# Altium project Analizador_de_espectro.PrjPcb
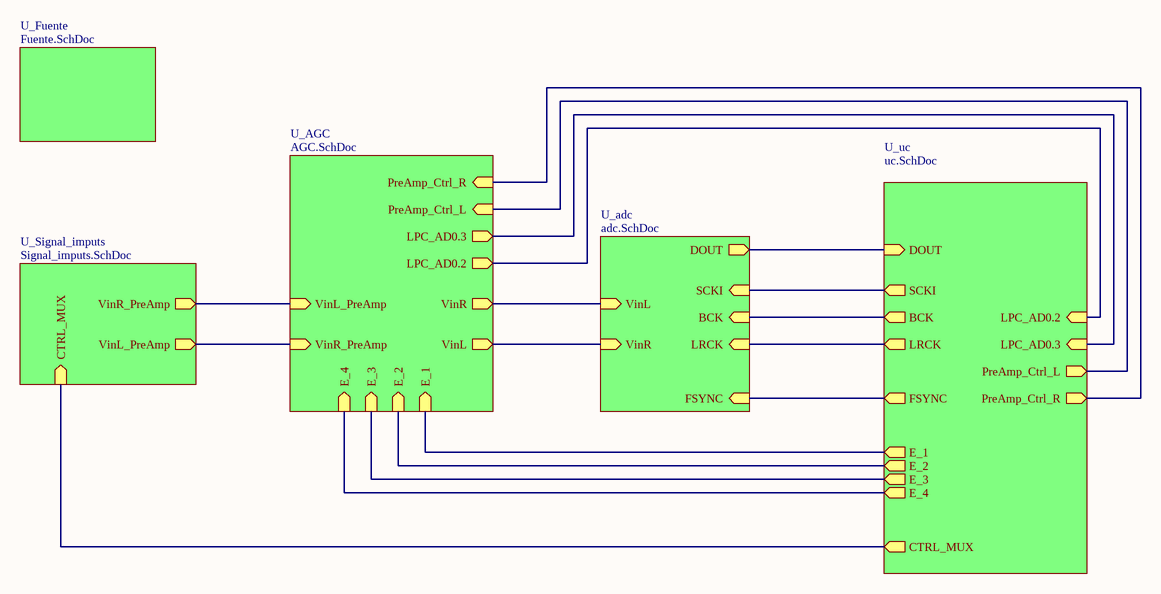
[diagram p0: Analizador_de_espectro.SchDoc]
6 sheets, 140 parts. Net scope: hierarchical (ports join the sheet entries above them; power ports are global).
Board file: Analizador_de_espectro.PcbDoc
Sheets:
  Analizador_de_espectro.SchDoc
    U_adc = adc.SchDoc
    U_Fuente = Fuente.SchDoc
    U_uc = uc.SchDoc
    U_AGC = AGC.SchDoc
    U_Signal_imputs = Signal_imputs.SchDoc

## Sheet Analizador_de_espectro.SchDoc: Analizador_de_Espectro_SCH
size A4; Date: 09/09/2017; Author: Hojnadel - Salazar Ato; Organization: UTN.FRBA; Revision: Rev1.0; SheetNumber: 1; SheetTotal: 6

### Sub-sheets
U_adc = adc.SchDoc: SCKI (in), DOUT (out), BCK (in), LRCK (in), FSYNC (in), VinL (in), VinR (in)
U_AGC = AGC.SchDoc: VinR (out), VinL (out), VinL_PreAmp (in), VinR_PreAmp (in), E_1 (in), E_2 (in), E_3 (in), E_4 (in), PreAmp_Ctrl_L (in), PreAmp_Ctrl_R (in), LPC_AD0.3 (out), LPC_AD0.2 (out)
U_Fuente = Fuente.SchDoc: no entries
U_Signal_imputs = Signal_imputs.SchDoc: CTRL_MUX (in), VinR_PreAmp (out), VinL_PreAmp (out)
U_uc = uc.SchDoc: DOUT (in), BCK (out), LRCK (out), SCKI (out), FSYNC (out), CTRL_MUX (out), E_2 (out), E_3 (out), E_1 (out), E_4 (out), PreAmp_Ctrl_L (out), PreAmp_Ctrl_R (out), LPC_AD0.3 (in), LPC_AD0.2 (in)

### Nets
CTRL_MUX: sheet U_uc/CTRL_MUX, sheet U_Signal_imputs/CTRL_MUX
E1: sheet U_uc/E_1, sheet U_AGC/E_1
E2: sheet U_uc/E_2, sheet U_AGC/E_2
E3: sheet U_uc/E_3, sheet U_AGC/E_3
E4: sheet U_uc/E_4, sheet U_AGC/E_4
R_Sw_B_1: sheet U_adc/VinR, sheet U_AGC/VinL
R_Sw_B_2: sheet U_adc/VinL, sheet U_AGC/VinR
VinL: sheet U_AGC/VinR_PreAmp, sheet U_Signal_imputs/VinL_PreAmp
VinR: sheet U_AGC/VinL_PreAmp, sheet U_Signal_imputs/VinR_PreAmp
NetIC1_9: sheet U_adc/FSYNC, sheet U_uc/FSYNC
NetIC1_10: sheet U_adc/LRCK, sheet U_uc/LRCK
NetIC1_11: sheet U_adc/BCK, sheet U_uc/BCK
NetIC1_12: sheet U_adc/DOUT, sheet U_uc/DOUT
NetIC1_15: sheet U_adc/SCKI, sheet U_uc/SCKI
NetIC4_1: sheet U_uc/PreAmp_Ctrl_L, sheet U_AGC/PreAmp_Ctrl_L
NetIC4_5: sheet U_uc/PreAmp_Ctrl_R, sheet U_AGC/PreAmp_Ctrl_R
NetIC4_7: sheet U_uc/LPC_AD0.2, sheet U_AGC/LPC_AD0.2
NetIC4_9: sheet U_uc/LPC_AD0.3, sheet U_AGC/LPC_AD0.3

## Sheet adc.SchDoc: ADC_PCM1802_SCH
size A3; Author: Hojnadel - Salazar Ato; Revision: Rev1.0; SheetNumber: 5; SheetTotal: 6
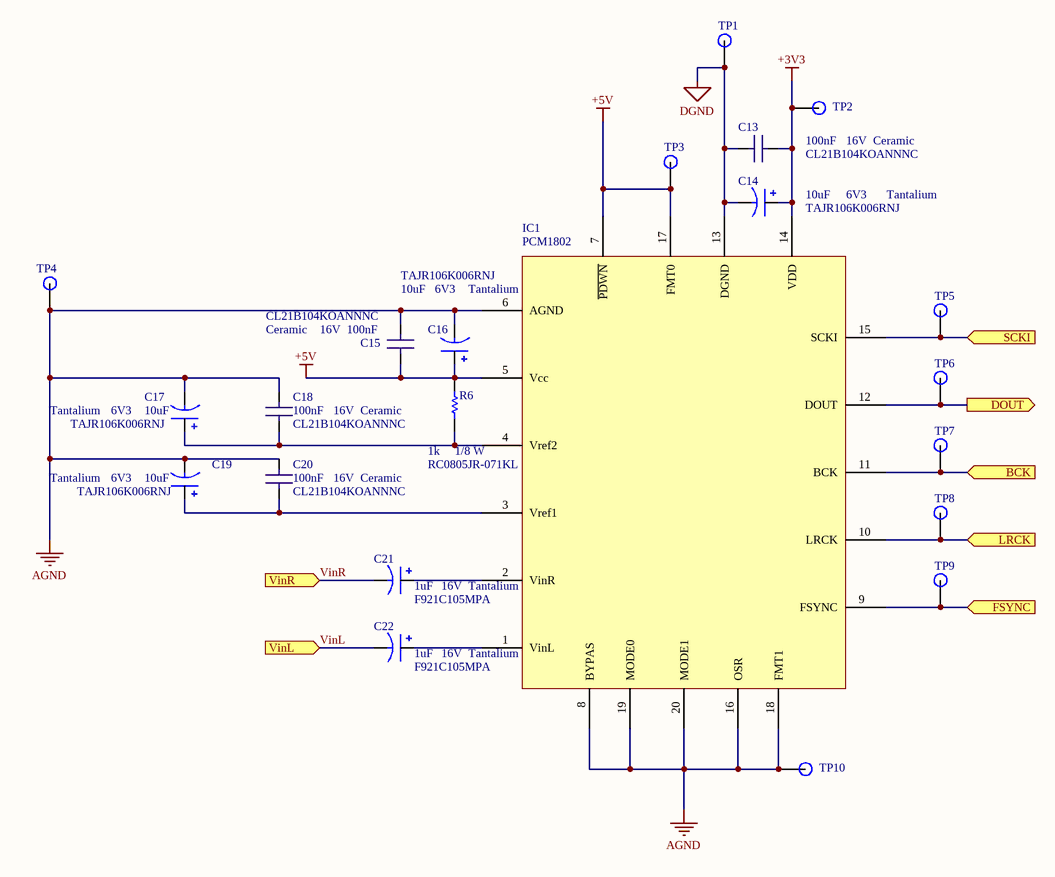
[diagram p1: adc.SchDoc]

### Parts
C13  C: 100nF  V: 16V  Part Number: CL21B104KOANNNC  Material: Ceramic  [C_0805]  (hidden comment: 100nF 16V Ceramic)
C14  C: 10uF  V: 6V3  Material: Tantalium  Part number: TAJR106K006RNJ  [C_0805_pol]  (hidden comment: 10uF 6V3 Tantalium)
C15  C: 100nF  V: 16V  Part Number: CL21B104KOANNNC  Material: Ceramic  [C_0805]  (hidden comment: 100nF 16V Ceramic)
C16  C: 10uF  V: 6V3  Material: Tantalium  Part number: TAJR106K006RNJ  [C_0805_pol]  (hidden comment: 10uF 6V3 Tantalium)
C17  C: 10uF  V: 6V3  Material: Tantalium  Part number: TAJR106K006RNJ  [C_0805_pol]  (hidden comment: 10uF 6V3 Tantalium)
C18  C: 100nF  V: 16V  Part Number: CL21B104KOANNNC  Material: Ceramic  [C_0805]  (hidden comment: 100nF 16V Ceramic)
C19  C: 10uF  V: 6V3  Material: Tantalium  Part number: TAJR106K006RNJ  [C_0805_pol]  (hidden comment: 10uF 6V3 Tantalium)
C20  C: 100nF  V: 16V  Part Number: CL21B104KOANNNC  Material: Ceramic  [C_0805]  (hidden comment: 100nF 16V Ceramic)
C21  C: 1uF  V: 16V  Material: Tantalium  Part number: F921C105MPA  [C_0805_pol]  (hidden comment: 1uF 16V Tantalium)
C22  C: 1uF  V: 16V  Material: Tantalium  Part number: F921C105MPA  [C_0805_pol]  (hidden comment: 1uF 16V Tantalium)
IC1  PCM1802  [SSOP_DB20]
R6  value 1k  Power: 1/8 W  Part Number: RC0805JR-071KL  [R_0805]  (hidden comment: 1k 1/8W)
TP1  TP  [TP]  (value not drawn)
TP2  TP  [TP]  (value not drawn)
TP3  TP  [TP]  (value not drawn)
TP4  TP  [TP]  (value not drawn)
TP5  TP  [TP]  (value not drawn)
TP6  TP  [TP]  (value not drawn)
TP7  TP  [TP]  (value not drawn)
TP8  TP  [TP]  (value not drawn)
TP9  TP  [TP]  (value not drawn)
TP10  TP  [TP]  (value not drawn)

### Ports
BCK (in), DOUT (out), FSYNC (in), LRCK (in), SCKI (in), VinL (in), VinR (in)

### Nets
+3V3: C13.2 C14.1 IC1.14(VDD) TP2.1  [project net VCC]
+5V: C15.2 C16.1 IC1.5(Vcc) IC1.7(~{PDWN}) IC1.17(FMT0) R6.1 TP3.1
AGND: C15.1 C16.2 C17.2 C18.1 C19.2 C20.1 IC1.6(AGND) IC1.8(BYPAS) IC1.16(OSR) IC1.18(FMT1) IC1.19(MODE0) IC1.20(MODE1) TP4.1 TP10.1
DGND: C13.1 C14.2 IC1.13(DGND) TP1.1  [project net GND]
VinL: C22.2 ; port VinL  [project net R_Sw_B_2]
VinR: C21.2 ; port VinR  [project net R_Sw_B_1]
NetC17_1: C17.1 C18.2 IC1.4(Vref2) R6.2
NetC19_1: C19.1 C20.2 IC1.3(Vref1)
NetC21_1: C21.1 IC1.2(VinR)
NetC22_1: C22.1 IC1.1(VinL)
NetIC1_9: IC1.9(FSYNC) TP9.1 ; port FSYNC
NetIC1_10: IC1.10(LRCK) TP8.1 ; port LRCK
NetIC1_11: IC1.11(BCK) TP7.1 ; port BCK
NetIC1_12: IC1.12(DOUT) TP6.1 ; port DOUT
NetIC1_15: IC1.15(SCKI) TP5.1 ; port SCKI

### Notes on the sheet
- (in symbol Cap1) Ceramico

### Library data of the parts
C13 C15 C18 C20 = Cap1: Capacitor
C14 C16 C17 C19 C21 C22 = Cap_Elec: Capacitor
IC1 = PCM1802: Part Number: PCM1802DBR
R6 = Res1: Resistor
TP1-TP10 = Test Point

## Sheet Fuente.SchDoc: Fuente_SCH
size A4; Author: Hojnadel - Salazar Ato; Revision: Rev1.0; SheetNumber: 2; SheetTotal: 6
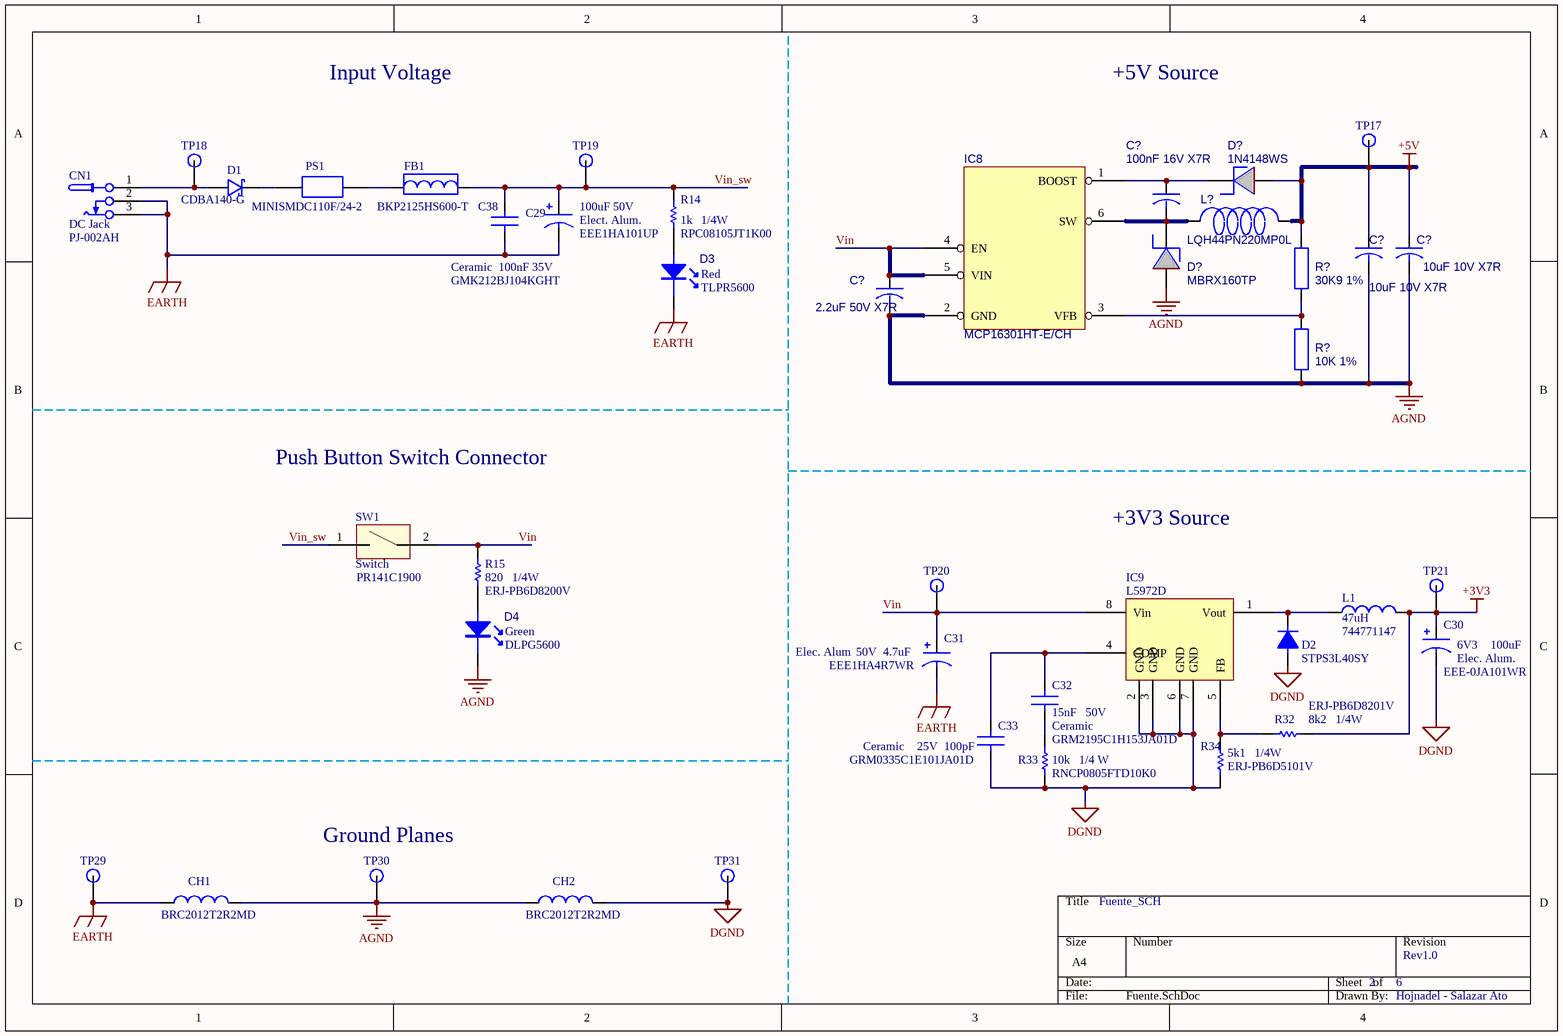
[diagram p2: Fuente.SchDoc]

### Parts
(Parts that share a designator on the sheet are numbered #1, #2 ... from top to bottom, then left to right.)
C29  C: 100uF  V: 50V  Material: Elect. Alum.  Part number: EEE1HA101UP  [C_AE10083X105M]  (hidden comment: 100uF 50V ElecAlum)
C30  C: 100uF  V: 6V3  Material: Elec. Alum.  Part number: EEE-0JA101WR  [C_AE6553X54M]  (hidden comment: 100uF 6V3 ElecAlum)
C31  C: 4.7uF  V: 50V  Material: Elec. Alum  Part number: EEE1HA4R7WR  [C_AE6553X54M]  (hidden comment: 4.7uF 50V ElecAlum)
C32  C: 15nF  V: 50V  Part Number: GRM2195C1H153JA01D  Material: Ceramic  [C_0805]  (hidden comment: 15nF 50V Ceramic)
C33  C: 100pF  V: 25V  Part Number: GRM0335C1E101JA01D  Material: Ceramic  [C_0805]  (hidden comment: 100pF 25V Ceramic)
C38  C: 100nF  V: 35V  Part Number: GMK212BJ104KGHT  Material: Ceramic  [C_0805]  (hidden comment: 100nF 35V Ceramic)
C?#1  100nF 16V X7R  [C_0805]
C?#2  10uF 10V X7R  [C_0805]
C?#3  10uF 10V X7R  [C_0805]
C?#4  2.2uF 50V X7R  [C_0805]
CH1  Part Number: BRC2012T2R2MD  [I_CHOQUE_DFN]  (hidden comment: Choke)
CH2  Part Number: BRC2012T2R2MD  [I_CHOQUE_DFN]  (hidden comment: Choke)
CN1  DC Jack  Part Number: PJ-002AH  [Jack_PJ002A]
D1  CDBA140-G  [D_DO-214AC_Schottky]
D2  Part Number: STPS3L40SY  [D_M6959X25N]  (hidden comment: STPS3L40)
D3  Color: Red  Part Number: TLPR5600  [Led_TH]  (hidden comment: LED)
D4  Part Number: DLPG5600  Color: Green  [Led_TH]  (hidden comment: LED)
D?#1  1N4148WS  [SOD_323]
D?#2  MBRX160TP  [SOD_123]
FB1  Part Number: BKP2125HS600-T  [Ferrite_bead]  (hidden comment: Ferrite Bead)
IC8  MCP16301HT-E/CH  [SOT23_6P]
IC9  L5972D  [SO8]
L1  Part Number: 744771147  [I_P128122X60N]  (hidden comment: 47uH)
L?  LQH44PN220MP0L  [VLCF5028]
PS1  Part Number: MINISMDC110F/24-2  [POLISWITCH_1]  (hidden comment: Polyswitch)
R14  value 1k  Potencia: 1/4W  Part Number: RPC08105JT1K00  [R_0805]  (hidden comment: Res1)
R15  value 820  Potencia: 1/4W  Part Number: ERJ-PB6D8200V  [R_0805]  (hidden comment: Res1)
R32  value 8k2  Part Number: ERJ-PB6D8201V  Power: 1/4W  [R_0805]  (hidden comment: 8k2 1/4W)
R33  value 10k  Part Number: RNCP0805FTD10K0  Power: 1/4 W  [R_0805]  (hidden comment: 10k 1/4W)
R34  value 5k1  Part Number: ERJ-PB6D5101V  Power: 1/4W  [R_0805]  (hidden comment: 5k1 1/4W)
R?#1  30K9 1%  [R_0805]
R?#2  10K 1%  [R_0805]
SW1  Switch  Part Number: PR141C1900  [BORNERA_2X5MM]
TP17  TP  [TP]  (value not drawn)
TP18  TP  [TP]  (value not drawn)
TP19  TP  [TP]  (value not drawn)
TP20  TP  [TP]  (value not drawn)
TP21  TP  [TP]  (value not drawn)
TP29  TP  [TP]  (value not drawn)
TP30  TP  [TP]  (value not drawn)
TP31  TP  [TP]  (value not drawn)

### Nets
+3V3: C30.1 L1.2 R32.1 TP21.1  [project net VCC]
+5V: C?#2.1 C?#3.1 D?#1.1(A) L?.2 R?#1.2 TP17.1
AGND: C?#2.2 C?#3.2 C?#4.2 CH1.2 CH2.1 D4.2 D?#2.1(A) IC8.2(GND) R?#2.1 TP30.1
DGND: C30.2 C33.2 CH2.2 D2.1 IC9.2(GND) IC9.3(GND) IC9.6(GND) IC9.7(GND) R33.1 R34.1 TP31.1  [project net GND]
EARTH: C29.2 C31.2 C38.2 CH1.1 CN1.2 CN1.3 D3.2 TP29.1
Vin: C31.1 C?#4.1 IC8.4(EN) IC8.5(VIN) IC9.8(Vin) R15.2 SW1.2 TP20.1
Vin_sw: C29.1 C38.1 FB1.2 R14.1 SW1.1 TP19.1
NetC32_1: C32.1 C33.1 IC9.4(COMP)
NetC32_2: C32.2 R33.2
NetC?#1_1: C?#1.1 D?#1.2(K) IC8.1(BOOST)
NetC?#1_2: C?#1.2 D?#2.2(K) IC8.6(SW) L?.1
NetCN1_1: CN1.1 D1.1(A) TP18.1
NetD1_2: D1.2(K) PS1.1
NetD2_2: D2.2 IC9.1(Vout) L1.1
NetD3_1: D3.1 R14.2
NetD4_1: D4.1 R15.1
NetFB1_1: FB1.1 PS1.2
NetIC8_3: IC8.3(VFB) R?#1.1 R?#2.2
NetIC9_5: IC9.5(FB) R32.2 R34.2

### Notes on the sheet
- Input Voltage
- +5V Source
- Push Button Switch Connector
- +3V3 Source
- (near TP30) Ground Planes

### Library data of the parts
C29-C31 = Cap_Elec: Capacitor
C32 C33 C38 = Cap1: Capacitor
C?#1-C?#4 = CAP: Capacitor
CN1 = Barrel_jack: Connector
D1 = Diodo_Schottky: Diodo Schottky; Part Number: CDBA140-G
D2 = DIODO: Diode
D?#1 = DIODO_SH: Diode Shottky
D?#2 = DIODO_SH: Diode schottky
IC8 = MCP16301: Buck 36V-adj 600mA SOT-6
IC9 = L5972D: Fuente Switching; Part Number: L5972D013TR
L1 = Inductor: Code_IEC: 1005; Published: 8-Jun-2000; LatestRevisionDate: 29-May-2009; LatestRevisionNote: IPC-7351 Footprint Added.; PackageReference: 0402-A; Publisher: Altium Limited; PackageDescription: Chip Inductor; Code_JEITA: 0402; Value: 47uH
L? = Inductor
PS1 = Poliswitch: Polishwitch
R14 R32-R34 = Res1: Resistor
R15 = Res1: Resistor; Tolerance: 5%
R?#1 R?#2 = RES: Resistor
SW1 = SW
TP17-TP21 TP29-TP31 = Test Point

## Sheet uc.SchDoc: uC_LPC1769_SCH
size A3; DrawnBy: Hojnadel - Salazar Ato; Revision: Rev1.0; SheetNumber: 6; SheetTotal: 6
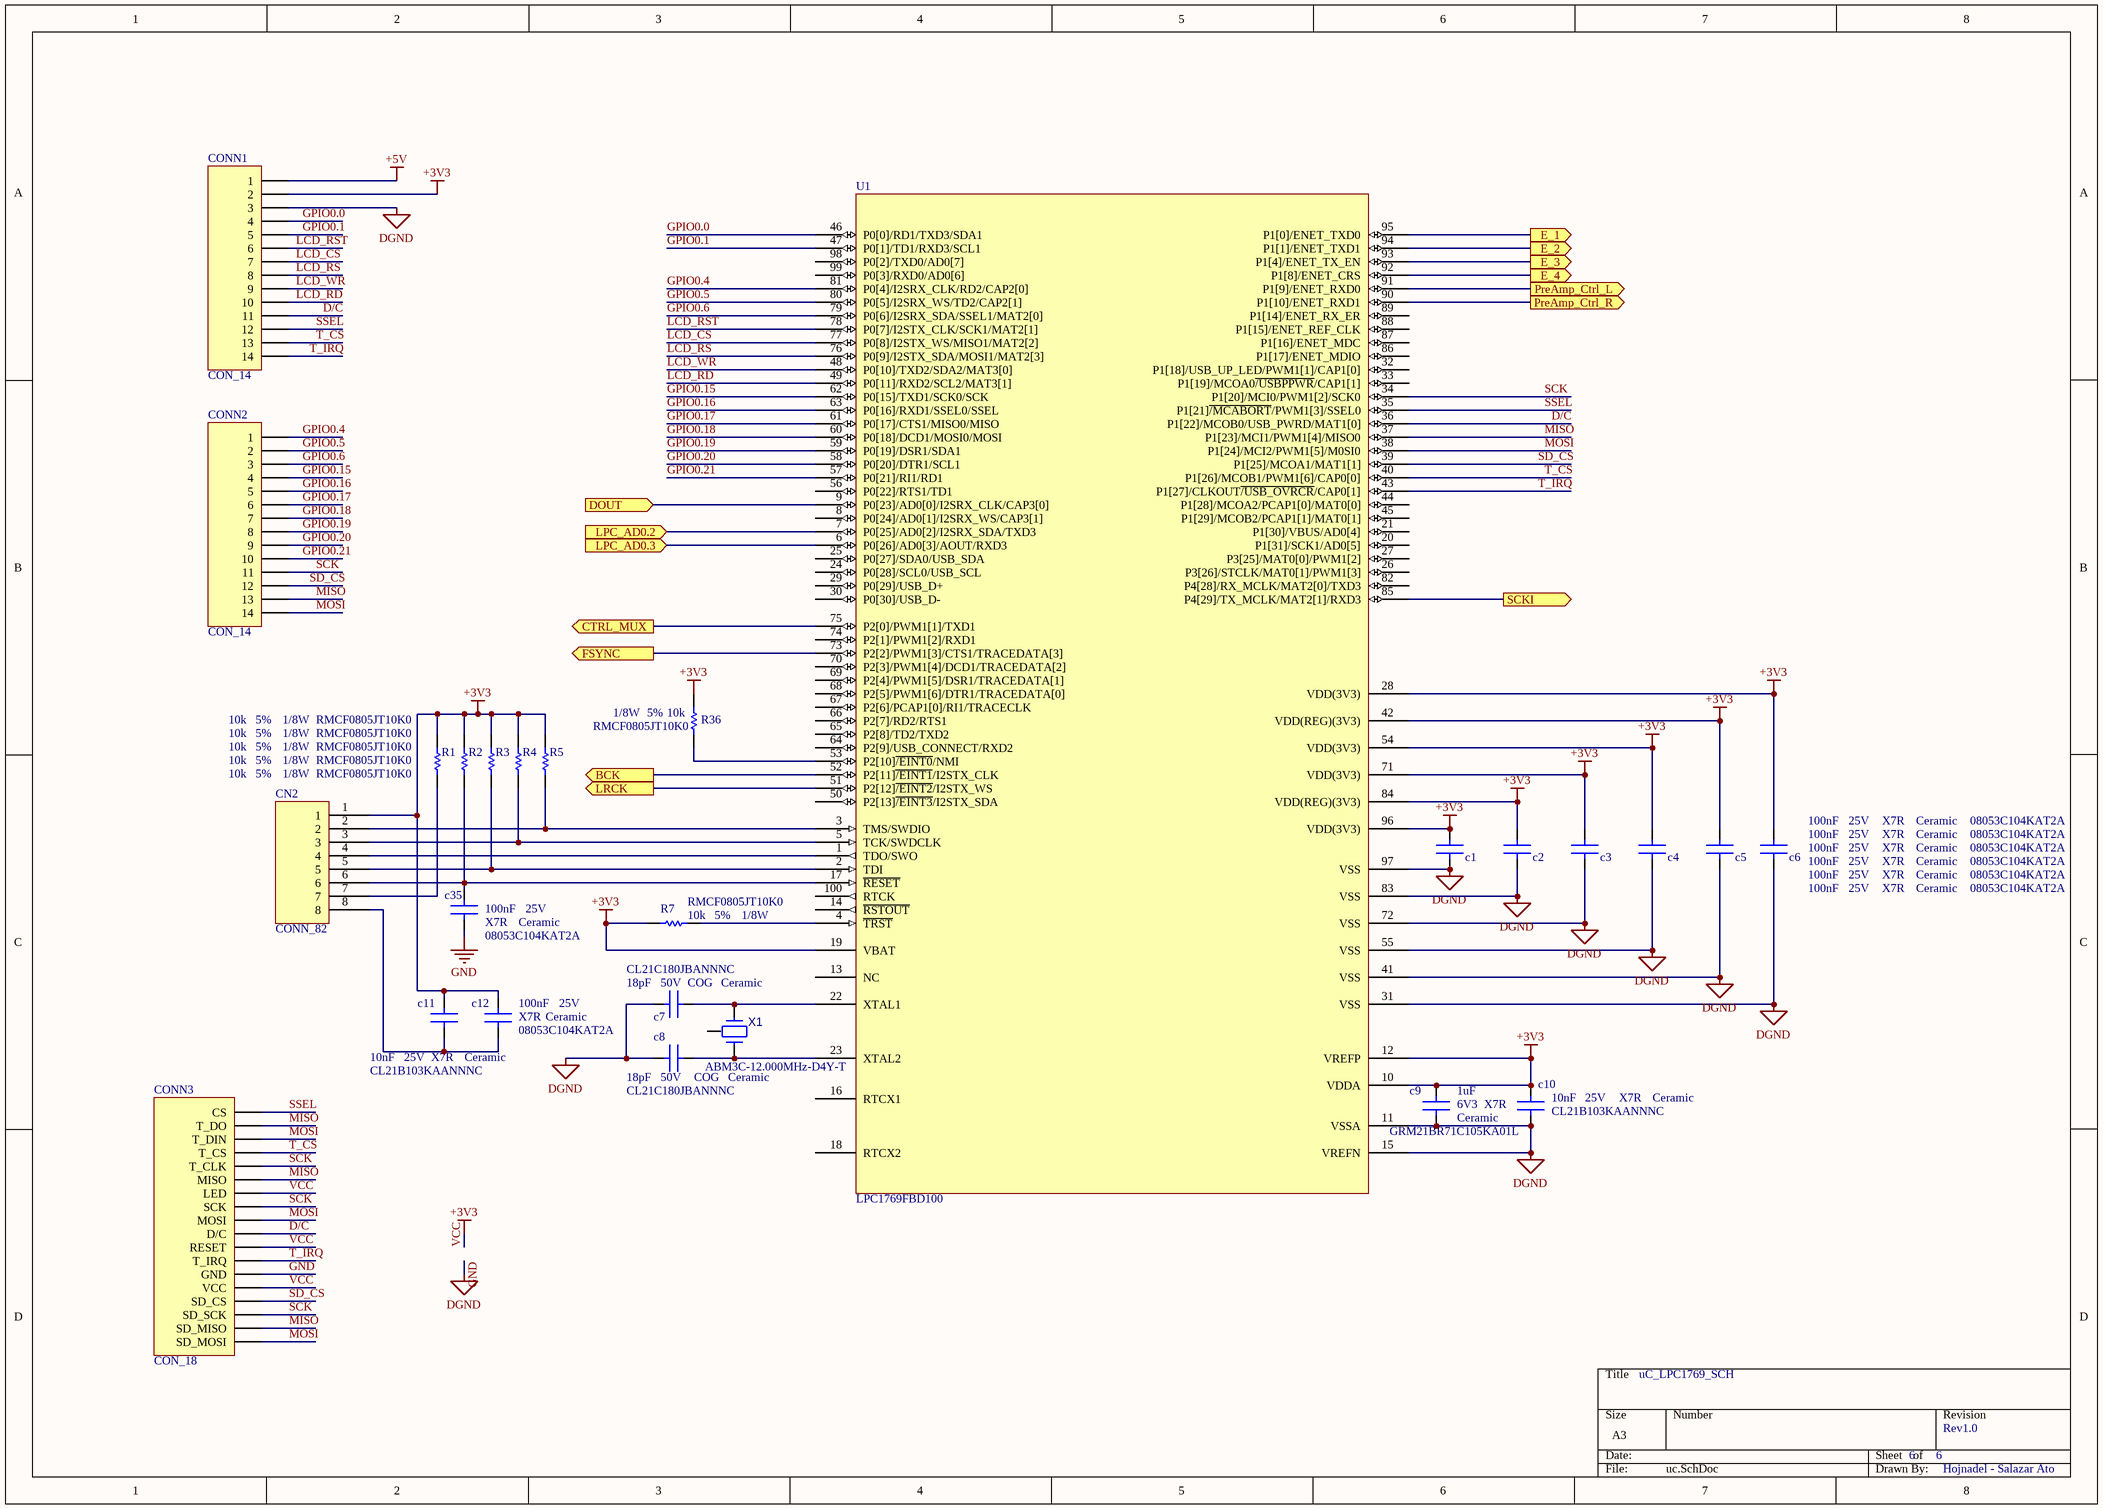
[diagram p3: uc.SchDoc]

### Parts
c1  C: 100nF  V: 25V  Part Number: 08053C104KAT2A  Temp Coef: X7R  Material: Ceramic  [C_0805]  (hidden comment: 100nF 25V X7R Ceramic)
c2  C: 100nF  V: 25V  Part Number: 08053C104KAT2A  Temp Coef: X7R  Material: Ceramic  [C_0805]  (hidden comment: 100nF 25V X7R Ceramic)
c3  C: 100nF  V: 25V  Part Number: 08053C104KAT2A  Temp Coef: X7R  Material: Ceramic  [C_0805]  (hidden comment: 100nF 25V X7R Ceramic)
c4  C: 100nF  V: 25V  Part Number: 08053C104KAT2A  Temp Coef: X7R  Material: Ceramic  [C_0805]  (hidden comment: 100nF 25V X7R Ceramic)
c5  C: 100nF  V: 25V  Part Number: 08053C104KAT2A  Temp Coef: X7R  Material: Ceramic  [C_0805]  (hidden comment: 100nF 25V X7R Ceramic)
c6  C: 100nF  V: 25V  Part Number: 08053C104KAT2A  Temp Coef: X7R  Material: Ceramic  [C_0805]  (hidden comment: 100nF 25V X7R Ceramic)
c7  C: 18pF  V: 50V  Part Number: CL21C180JBANNNC  Temp Coef: COG  Material: Ceramic  [C_0805]  (hidden comment: 18pF 50V COG Ceramic)
c8  C: 18pF  V: 50V  Part Number: CL21C180JBANNNC  Temp Coef: COG  Material: Ceramic  [C_0805]  (hidden comment: 18pF 50V COG Ceramic)
c9  C: 1uF  V: 6V3  Part Number: GRM21BR71C105KA01L  Temp Coef: X7R  Material: Ceramic  [C_0805]  (hidden comment: 1uF 6V3 X7R Ceramic)
c10  C: 10nF  V: 25V  Part Number: CL21B103KAANNNC  Temp Coef: X7R  Material: Ceramic  [C_0805]  (hidden comment: 10nF 25V X7R Ceramic)
c11  C: 10nF  V: 25V  Part Number: CL21B103KAANNNC  Temp Coef: X7R  Material: Ceramic  [C_0805]  (hidden comment: 10nF 25V X7R Ceramic)
c12  C: 100nF  V: 25V  Part Number: 08053C104KAT2A  Temp Coef: X7R  Material: Ceramic  [C_0805]  (hidden comment: 100nF 25V X7R Ceramic)
c35  C: 100nF  V: 25V  Temp Coef: X7R  Part Number: 08053C104KAT2A  Material: Ceramic  [C_0805]  (hidden comment: 100nF 25V X7R Ceramic)
CN2  CONN_82  [HDR_M_08P_0.1]
CONN1  CON_14  [1x14x2.54 Pin Header TH V]
CONN2  CON_14  [1x14x2.54 Pin Header TH V]
CONN3  CON_18  [2x9x2.54 Pin Header TH V]
R1  value 10k  Power: 1/8W  Part Number: RMCF0805JT10K0  Tolerance: 5%  [R_0805]  (hidden comment: 10k 5% 1/8W)
R2  value 10k  Part Number: RMCF0805JT10K0  Tolerance: 5%  Power: 1/8W  [R_0805]  (hidden comment: 10k 5% 1/8W)
R3  value 10k  Power: 1/8W  Part Number: RMCF0805JT10K0  Tolerance: 5%  [R_0805]  (hidden comment: 10k 5% 1/8W)
R4  value 10k  Power: 1/8W  Part Number: RMCF0805JT10K0  Tolerance: 5%  [R_0805]  (hidden comment: 10k 5% 1/8W)
R5  value 10k  Power: 1/8W  Part Number: RMCF0805JT10K0  Tolerance: 5%  [R_0805]  (hidden comment: 10k 5% 1/8W)
R7  value 10k  Power: 1/8W  Part Number: RMCF0805JT10K0  Tolerance: 5%  [R_0805]  (hidden comment: 10k 5% 1/8W)
R36  value 10k  Power: 1/8W  Part Number: RMCF0805JT10K0  Tolerance: 5%  [R_0805]  (hidden comment: 10k 5% 1/8W)
U1  LPC1769FBD100  [LQFP100]
X1  Part Number: ABM3C-12.000MHz-D4Y-T  [ABMC_XTAL]  (hidden comment: XTAL_HF)

### Ports
BCK (out), CTRL_MUX (out), DOUT (in), E_1 (out), E_2 (out), E_3 (out), E_4 (out), FSYNC (out), LPC_AD0.2 (in), LPC_AD0.3 (in), LRCK (out), PreAmp_Ctrl_L (out), PreAmp_Ctrl_R (out), SCKI (out)

### Nets
+5V: CONN1.1
GND: c1.2 c2.2 c3.2 c4.2 c5.2 c6.2 c7.1 c8.1 c9.2 c10.2 c35.2 CONN1.3 CONN3.13(GND) U1.11(VSSA) U1.15(VREFN) U1.31(VSS) U1.41(VSS) U1.55(VSS) U1.72(VSS) U1.83(VSS) U1.97(VSS)  [also labelled DGND]
VCC: c1.1 c2.1 c3.1 c4.1 c5.1 c6.1 c9.1 c10.1 c11.1 c12.1 CN2.1 CONN1.2 CONN3.7(LED) CONN3.11(RESET) CONN3.14(VCC) R1.2 R2.2 R3.2 R4.2 R5.2 R7.2 R36.2 U1.10(VDDA) U1.12(VREFP) U1.19(VBAT) U1.28(VDD(3V3)) U1.42(VDD(REG)(3V3)) U1.54(VDD(3V3)) U1.71(VDD(3V3)) U1.84(VDD(REG)(3V3)) U1.96(VDD(3V3))  [also labelled +3V3]
CTRL_MUX: U1.75(P2[0]/PWM1[1]/TXD1) ; port CTRL_MUX
D/C: CONN1.11 CONN3.10(D/C) U1.36(P1[22]/MCOB0/USB_PWRD/MAT1[0])
E1: U1.95(P1[0]/ENET_TXD0) ; port E_1
E2: U1.94(P1[1]/ENET_TXD1) ; port E_2
E3: U1.93(P1[4]/ENET_TX_EN) ; port E_3
E4: U1.92(P1[8]/ENET_CRS) ; port E_4
GPIO0.0: CONN1.4 U1.46(P0[0]/RD1/TXD3/SDA1)
GPIO0.1: CONN1.5 U1.47(P0[1]/TD1/RXD3/SCL1)
GPIO0.4: CONN2.1 U1.81(P0[4]/I2SRX_CLK/RD2/CAP2[0])
GPIO0.5: CONN2.2 U1.80(P0[5]/I2SRX_WS/TD2/CAP2[1])
GPIO0.6: CONN2.3 U1.79(P0[6]/I2SRX_SDA/SSEL1/MAT2[0])
GPIO0.15: CONN2.4 U1.62(P0[15]/TXD1/SCK0/SCK)
GPIO0.16: CONN2.5 U1.63(P0[16]/RXD1/SSEL0/SSEL)
GPIO0.17: CONN2.6 U1.61(P0[17]/CTS1/MISO0/MISO)
GPIO0.18: CONN2.7 U1.60(P0[18]/DCD1/MOSI0/MOSI)
GPIO0.19: CONN2.8 U1.59(P0[19]/DSR1/SDA1)
GPIO0.20: CONN2.9 U1.58(P0[20]/DTR1/SCL1)
GPIO0.21: CONN2.10 U1.57(P0[21]/RI1/RD1)
LCD_CS: CONN1.7 U1.77(P0[8]/I2STX_WS/MISO1/MAT2[2])
LCD_RD: CONN1.10 U1.49(P0[11]/RXD2/SCL2/MAT3[1])
LCD_RS: CONN1.8 U1.76(P0[9]/I2STX_SDA/MOSI1/MAT2[3])
LCD_RST: CONN1.6 U1.78(P0[7]/I2STX_CLK/SCK1/MAT2[1])
LCD_WR: CONN1.9 U1.48(P0[10]/TXD2/SDA2/MAT3[0])
MISO: CONN2.13 CONN3.2(T_DO) CONN3.6(MISO) CONN3.17(SD_MISO) U1.37(P1[23]/MCI1/PWM1[4]/MISO0)
MOSI: CONN2.14 CONN3.3(T_DIN) CONN3.9(MOSI) CONN3.18(SD_MOSI) U1.38(P1[24]/MCI2/PWM1[5]/M0SI0)
SCK: CONN2.11 CONN3.5(T_CLK) CONN3.8(SCK) CONN3.16(SD_SCK) U1.34(P1[20]/MCI0/PWM1[2]/SCK0)
SD_CS: CONN2.12 CONN3.15(SD_CS) U1.39(P1[25]/MCOA1/MAT1[1])
SSEL: CONN1.12 CONN3.1(CS) U1.35(P1[21]~{/MCABORT}/PWM1[3]/SSEL0)
T_CS: CONN1.13 CONN3.4(T_CS) U1.40(P1[26]/MCOB1/PWM1[6]/CAP0[0])
T_IRQ: CONN1.14 CONN3.12(T_IRQ) U1.43(P1[27]/CLKOUT~{/USB_OVRCR}/CAP0[1])
Netc7_2: c7.2 U1.22(XTAL1) X1.1
Netc8_2: c8.2 U1.23(XTAL2) X1.3
Netc11_2: c11.2 c12.2 CN2.8
Netc35_1: c35.1 CN2.6 R2.1 U1.17(~{RESET})
NetCN2_2: CN2.2 R5.1 U1.3(TMS/SWDIO)
NetCN2_3: CN2.3 R4.1 U1.5(TCK/SWDCLK)
NetCN2_4: CN2.4 U1.1(TDO/SWO)
NetCN2_5: CN2.5 R3.1 U1.2(TDI)
NetCN2_7: CN2.7 R1.1
NetIC1_9: U1.73(P2[2]/PWM1[3]/CTS1/TRACEDATA[3]) ; port FSYNC
NetIC1_10: U1.51(P2[12]~{/EINT2}/I2STX_WS) ; port LRCK
NetIC1_11: U1.52(P2[11]~{/EINT1}/I2STX_CLK) ; port BCK
NetIC1_12: U1.9(P0[23]/AD0[0]/I2SRX_CLK/CAP3[0]) ; port DOUT
NetIC1_15: U1.85(P4[29]/TX_MCLK/MAT2[1]/RXD3) ; port SCKI
NetIC4_1: U1.91(P1[9]/ENET_RXD0) ; port PreAmp_Ctrl_L
NetIC4_5: U1.90(P1[10]/ENET_RXD1) ; port PreAmp_Ctrl_R
NetIC4_7: U1.7(P0[25]/AD0[2]/I2SRX_SDA/TXD3) ; port LPC_AD0.2
NetIC4_9: U1.6(P0[26]/AD0[3]/AOUT/RXD3) ; port LPC_AD0.3
NetR7_1: R7.1 U1.4(~{TRST})
NetR36_1: R36.1 U1.53(P2[10]~{/EINT0}/NMI)
NetX1_2: X1.2(GND) X1.4

Not connected (* = marked no-connect by the designer): U1 8(P0[24]/AD0[1]/I2SRX_WS/CAP3[1]) 13(NC) 14(~{RSTOUT}) 16(RTCX1) 18(RTCX2) 20(P1[31]/SCK1/AD0[5]) 21(P1[30]/VBUS/AD0[4]) 24(P0[28]/SCL0/USB_SCL) 25(P0[27]/SDA0/USB_SDA) 26(P3[26]/STCLK/MAT0[1]/PWM1[3]) 27(P3[25]/MAT0[0]/PWM1[2]) 29(P0[29]/USB_D+) 30(P0[30]/USB_D-) 32(P1[18]/USB_UP_LED/PWM1[1]/CAP1[0]) 33(P1[19]/MCOA0~{/USBPPWR}/CAP1[1]) 44(P1[28]/MCOA2/PCAP1[0]/MAT0[0]) 45(P1[29]/MCOB2/PCAP1[1]/MAT0[1]) 50(P2[13]~{/EINT3}/I2STX_SDA) 56(P0[22]/RTS1/TD1) 64(P2[9]/USB_CONNECT/RXD2) 65(P2[8]/TD2/TXD2) 66(P2[7]/RD2/RTS1) 67(P2[6]/PCAP1[0]/RI1/TRACECLK) 68(P2[5]/PWM1[6]/DTR1/TRACEDATA[0]) 69(P2[4]/PWM1[5]/DSR1/TRACEDATA[1]) 70(P2[3]/PWM1[4]/DCD1/TRACEDATA[2]) 74(P2[1]/PWM1[2]/RXD1) 82(P4[28]/RX_MCLK/MAT2[0]/TXD3) 86(P1[17]/ENET_MDIO) 87(P1[16]/ENET_MDC) 88(P1[15]/ENET_REF_CLK) 89(P1[14]/ENET_RX_ER) 98(P0[2]/TXD0/AD0[7]) 99(P0[3]/RXD0/AD0[6]) 100(RTCK)

### Library data of the parts
c1-c12 c35 = Cap1: Capacitor
CONN1 CONN2 = CON_14: CONN TFT 3.5
CONN3 = CON_18: CON_TFT_2.8
R1-R5 R7 R36 = Res1: Resistor
U1 = LPC1768FBD100: CPU Cortex M3; Part Number: LPC1769FBD100
X1 = XTAL_HF: Crystal

## Sheet AGC.SchDoc: AGC_SCH
size A4; Author: Hojnadel - Salazar Ato; Revision: Rev1.0; SheetNumber: 4; SheetTotal: 6
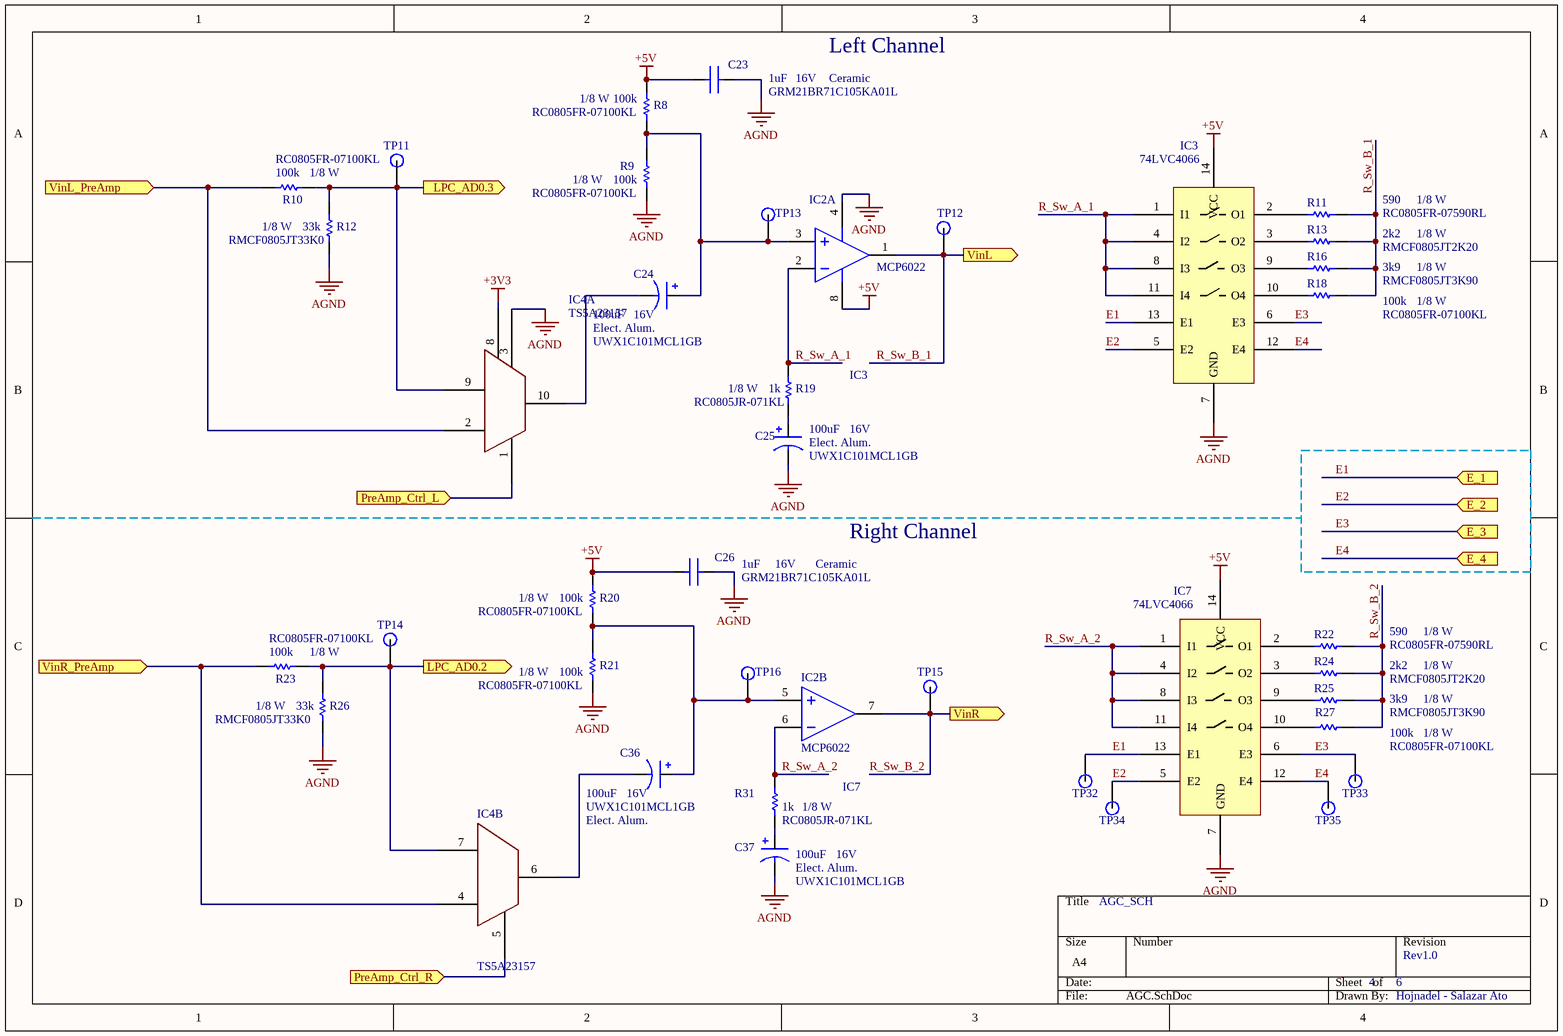
[diagram p4: AGC.SchDoc]

### Parts
C23  C: 1uF  V: 16V  Part Number: GRM21BR71C105KA01L  Material: Ceramic  [C_0805]  (hidden comment: 1uF 16V Ceramic)
C24  C: 100uF  V: 16V  Material: Elect. Alum.  Part number: UWX1C101MCL1GB  [C_AE7066X54M]  (hidden comment: 100uF 16V Elect. Alum.)
C25  C: 100uF  V: 16V  Material: Elect. Alum.  Part number: UWX1C101MCL1GB  [C_AE7066X54M]  (hidden comment: 100uF 16V Elect. Alum.)
C26  C: 1uF  V: 16V  Part Number: GRM21BR71C105KA01L  Material: Ceramic  [C_0805]  (hidden comment: 1uF 16V Ceramic)
C36  C: 100uF  V: 16V  Material: Elect. Alum.  Part number: UWX1C101MCL1GB  [C_AE7066X54M]  (hidden comment: 100uF 16V Elect. Alum.)
C37  C: 100uF  V: 16V  Material: Elect. Alum.  Part number: UWX1C101MCL1GB  [C_AE7066X54M]  (hidden comment: 100uF 16V Elect. Alum.)
IC2  MCP6022  [SOIC_D8]  (parts A,B of 2)
IC3  74LVC4066  [SO14]
IC4  TS5A23157  [TSSOP50P490X110-10N]  (parts A,B of 2)
IC7  74LVC4066  [SO14]
R8  value 100k  Power: 1/8 W  Part Number: RC0805FR-07100KL  [R_0805]  (hidden comment: 100k 1/8W)
R9  value 100k  Power: 1/8 W  Part Number: RC0805FR-07100KL  [R_0805]  (hidden comment: 100k 1/8W)
R10  value 100k  Power: 1/8 W  Part Number: RC0805FR-07100KL  [R_0805]  (hidden comment: 100k 1/8W)
R11  value 590  Power: 1/8 W  Part Number: RC0805FR-07590RL  [R_0805]  (hidden comment: 590 1/8W)
R12  value 33k  Power: 1/8 W  Part Number: RMCF0805JT33K0  [R_0805]  (hidden comment: 33k 1/8W)
R13  value 2k2  Power: 1/8 W  Part Number: RMCF0805JT2K20  [R_0805]  (hidden comment: 2k2 1/8W)
R16  value 3k9  Power: 1/8 W  Part Number: RMCF0805JT3K90  [R_0805]  (hidden comment: 3k9 1/8W)
R18  value 100k  Power: 1/8 W  Part Number: RC0805FR-07100KL  [R_0805]  (hidden comment: 100k 1/8W)
R19  value 1k  Power: 1/8 W  Part Number: RC0805JR-071KL  [R_0805]  (hidden comment: 1k 1/8W)
R20  value 100k  Power: 1/8 W  Part Number: RC0805FR-07100KL  [R_0805]  (hidden comment: 100k 1/8W)
R21  value 100k  Power: 1/8 W  Part Number: RC0805FR-07100KL  [R_0805]  (hidden comment: 100k 1/8W)
R22  value 590  Power: 1/8 W  Part Number: RC0805FR-07590RL  [R_0805]  (hidden comment: 590 1/8W)
R23  value 100k  Power: 1/8 W  Part Number: RC0805FR-07100KL  [R_0805]  (hidden comment: 100k 1/8W)
R24  value 2k2  Power: 1/8 W  Part Number: RMCF0805JT2K20  [R_0805]  (hidden comment: 2k2 1/8W)
R25  value 3k9  Power: 1/8 W  Part Number: RMCF0805JT3K90  [R_0805]  (hidden comment: 3k9 1/8W)
R26  value 33k  Power: 1/8 W  Part Number: RMCF0805JT33K0  [R_0805]  (hidden comment: 33k 1/8W)
R27  value 100k  Power: 1/8 W  Part Number: RC0805FR-07100KL  [R_0805]  (hidden comment: 100k 1/8W)
R31  value 1k  Power: 1/8 W  Part Number: RC0805JR-071KL  [R_0805]  (hidden comment: 1k 1/8W)
TP11  TP  [TP]  (value not drawn)
TP12  TP  [TP]  (value not drawn)
TP13  TP  [TP]  (value not drawn)
TP14  TP  [TP]  (value not drawn)
TP15  TP  [TP]  (value not drawn)
TP16  TP  [TP]  (value not drawn)
TP32  TP  [TP]  (value not drawn)
TP33  TP  [TP]  (value not drawn)
TP34  TP  [TP]  (value not drawn)
TP35  TP  [TP]  (value not drawn)

### Ports
E_1 (in), E_2 (in), E_3 (in), E_4 (in), LPC_AD0.2 (out), LPC_AD0.3 (out), PreAmp_Ctrl_L (in), PreAmp_Ctrl_R (in), VinL (out), VinL_PreAmp (in), VinR (out), VinR_PreAmp (in)

### Nets
+3V3: IC4.8(VDD)  [project net VCC]
+5V: C23.1 C26.1 IC2.8(VDD) IC3.14(VCC) IC7.14(VCC) R8.2 R20.2
AGND: C23.2 C25.2 C26.2 C37.2 IC2.4(VSS) IC3.7(GND) IC4.3(DGND) IC7.7(GND) R9.1 R12.2 R21.1 R26.2
E1: IC3.13(E1) IC7.13(E1) TP32.1 ; port E_1
E2: IC3.5(E2) IC7.5(E2) TP34.1 ; port E_2
E3: IC3.6(E3) IC7.6(E3) TP33.1 ; port E_3
E4: IC3.12(E4) IC7.12(E4) TP35.1 ; port E_4
R_Sw_A_1: IC2.2(IN-) IC3.1(I1) IC3.4(I2) IC3.8(I3) IC3.11(I4) R19.1
R_Sw_A_2: IC2.6(IN-) IC7.1(I1) IC7.4(I2) IC7.8(I3) IC7.11(I4) R31.1
R_Sw_B_1: IC2.1(OUT) R11.1 R13.1 R16.1 R18.1 TP12.1 ; port VinL
R_Sw_B_2: IC2.7(OUT) R22.1 R24.1 R25.1 R27.1 TP15.1 ; port VinR
VinL: IC4.4(NO2) R23.1 ; port VinR_PreAmp
VinR: IC4.2(NO1) R10.1 ; port VinL_PreAmp
NetC24_1: C24.1 IC2.3(IN+) R8.1 R9.2 TP13.1
NetC24_2: C24.2 IC4.10(COM1)
NetC25_1: C25.1 R19.2
NetC36_1: C36.1 IC2.5(IN+) R20.1 R21.2 TP16.1
NetC36_2: C36.2 IC4.6(COM2)
NetC37_1: C37.1 R31.2
NetIC3_2: IC3.2(O1) R11.2
NetIC3_3: IC3.3(O2) R13.2
NetIC3_9: IC3.9(O3) R16.2
NetIC3_10: IC3.10(O4) R18.2
NetIC4_1: IC4.1(IN1) ; port PreAmp_Ctrl_L
NetIC4_5: IC4.5(IN2) ; port PreAmp_Ctrl_R
NetIC4_7: IC4.7(NC2) R23.2 R26.1 TP14.1 ; port LPC_AD0.2
NetIC4_9: IC4.9(NC1) R10.2 R12.1 TP11.1 ; port LPC_AD0.3
NetIC7_2: IC7.2(O1) R22.2
NetIC7_3: IC7.3(O2) R24.2
NetIC7_9: IC7.9(O3) R25.2
NetIC7_10: IC7.10(O4) R27.2

### Notes on the sheet
- Left Channel
- IC3
- Right Channel
- IC7

### Library data of the parts
C23 C26 = Cap1: Capacitor
C24 C25 C36 C37 = Cap_Elec: Capacitor
IC2 = OpAmp_Dual
IC3 IC7 = Q_B_Switch_2: Part Number: 74LVC4066BQ,115
IC4 = A_SW_2x2:1_VSSOP: Analog Switch; Part Number: TS5A23157
R8-R13 R16 R18-R27 R31 = Res1: Resistor
TP11-TP16 TP32-TP35 = Test Point

## Sheet Signal_imputs.SchDoc: Signal_Imputs_SCH
size A4; Author: Hojnadel - Salazar, Ato; Revision: Rev1.0; SheetNumber: 3; SheetTotal: 6
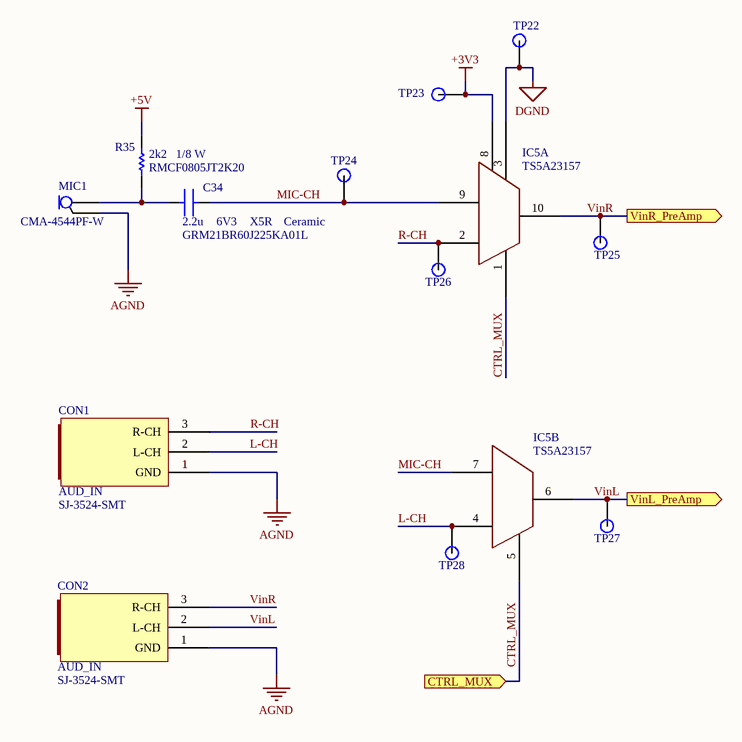
[diagram p5: Signal_imputs.SchDoc]

### Parts
C34  C: 2.2u  V: 6V3  Temp Coef: X5R  Part Number: GRM21BR60J225KA01L  Material: Ceramic  [C_0805]  (hidden comment: 2.2u 6V3 X5R Ceramic)
CON1  AUD_IN  Part Number: SJ-3524-SMT  [AUDIO_JACK 3.5mm SMD]
CON2  AUD_IN  Part Number: SJ-3524-SMT  [AUDIO_JACK 3.5mm SMD]
IC5  TS5A23157  [TSSOP50P490X110-10N]  (parts A,B of 2)
MIC1  Part Number: CMA-4544PF-W  [MIC_CMA-4544PF-W]  (hidden comment: Mic)
R35  value 2k2  Part Number: RMCF0805JT2K20  Power: 1/8 W  [R_0805]  (hidden comment: 2k2 1/8W)
TP22  TP  [TP]  (value not drawn)
TP23  TP  [TP]  (value not drawn)
TP24  TP  [TP]  (value not drawn)
TP25  TP  [TP]  (value not drawn)
TP26  TP  [TP]  (value not drawn)
TP27  TP  [TP]  (value not drawn)
TP28  TP  [TP]  (value not drawn)

### Ports
CTRL_MUX (in), VinL_PreAmp (out), VinR_PreAmp (out)

### Nets
+3V3: IC5.8(VDD) TP23.1  [project net VCC]
+5V: R35.2
AGND: CON1.1(GND) CON2.1(GND) MIC1.2
DGND: IC5.3(DGND) TP22.1  [project net GND]
CTRL_MUX: IC5.1(IN1) IC5.5(IN2) ; port CTRL_MUX
L-CH: CON1.2(L-CH) IC5.4(NO2) TP28.1
MIC-CH: C34.2 IC5.7(NC2) IC5.9(NC1) TP24.1
R-CH: CON1.3(R-CH) IC5.2(NO1) TP26.1
VinL: CON2.2(L-CH) IC5.6(COM2) TP27.1 ; port VinL_PreAmp
VinR: CON2.3(R-CH) IC5.10(COM1) TP25.1 ; port VinR_PreAmp
NetC34_1: C34.1 MIC1.1 R35.1

### Library data of the parts
C34 = Cap1: Capacitor
CON1 CON2 = Jack_1
IC5 = A_SW_2x2:1_VSSOP: Analog Switch; Part Number: TS5A23157
MIC1 = Mic: Microfono
R35 = Res1: Resistor
TP22-TP28 = Test Point

## Nets that join several sheets
+5V: adc (7 pins), Fuente (6 pins), uc (CONN1.1), AGC (7 pins), Signal_imputs (R35.2)
AGND: adc (14 pins), Fuente (10 pins), AGC (12 pins), Signal_imputs (CON1.1 CON2.1 MIC1.2)
GND: adc (C13.1 C14.2 IC1.13 TP1.1), Fuente (11 pins), uc (21 pins), Signal_imputs (IC5.3 TP22.1)
VCC: adc (C13.2 C14.1 IC1.14 TP2.1), Fuente (C30.1 L1.2 R32.1 TP21.1), uc (31 pins), AGC (IC4.8), Signal_imputs (IC5.8 TP23.1)
CTRL_MUX: uc (U1.75), Signal_imputs (IC5.1 IC5.5)
E1: uc (U1.95), AGC (IC3.13 IC7.13 TP32.1)
E2: uc (U1.94), AGC (IC3.5 IC7.5 TP34.1)
E3: uc (U1.93), AGC (IC3.6 IC7.6 TP33.1)
E4: uc (U1.92), AGC (IC3.12 IC7.12 TP35.1)
NetIC1_9: adc (IC1.9 TP9.1), uc (U1.73)
NetIC1_10: adc (IC1.10 TP8.1), uc (U1.51)
NetIC1_11: adc (IC1.11 TP7.1), uc (U1.52)
NetIC1_12: adc (IC1.12 TP6.1), uc (U1.9)
NetIC1_15: adc (IC1.15 TP5.1), uc (U1.85)
NetIC4_1: uc (U1.91), AGC (IC4.1)
NetIC4_5: uc (U1.90), AGC (IC4.5)
NetIC4_7: uc (U1.7), AGC (IC4.7 R23.2 R26.1 TP14.1)
NetIC4_9: uc (U1.6), AGC (IC4.9 R10.2 R12.1 TP11.1)
R_Sw_B_1: adc (C21.2), AGC (6 pins)
R_Sw_B_2: adc (C22.2), AGC (6 pins)
VinL: AGC (IC4.4 R23.1), Signal_imputs (CON2.2 IC5.6 TP27.1)
VinR: AGC (IC4.2 R10.1), Signal_imputs (CON2.3 IC5.10 TP25.1)